# Altium project Ultrasound Smart Probe_Ver2.PrjPcb (part 5 of 9)

## Sheet LVPS RX Supply 3V3 and 1V2_1.SchDoc: LVPS RX Supply 3V3 and 1V2
size 431 x 279 mm; Date: Not shown in title block; ApprovedBy: Not shown in title block; CheckedBy: Not shown in title block; Author: Not shown in title block; CompanyName: Not shown in title block; DrawnBy: Abhishek Vishwa; Engineer: Not shown in title block; Organization: Not shown in title block; Address1: Not shown in title block; Address2: Not shown in title block; Address3: Not shown in title block; Address4: Not shown in title block; DocumentNumber: 1; Revision: Use project parameter SCH_Rev; SheetNumber: 8; SheetTotal: 12; PageSetup: Record=PageOptions|CenterHorizontal=True|CenterVertical=True|PrintScale=1.00|XCorrection=1.00|YCorrection=1.00|PrintKind=0|BorderSize=5000000|LeftOffset=0|BottomOffset=0|Orientation=2|PaperLength=1000|PaperWidth=1000|Scale=100|PaperSource=15|PrintQuality=600|MediaType=1|DitherType=10|PaperKind=Letter|PrintScaleMode=1; CurrentTime: Not shown in title block; CurrentDate: Not shown in title block; Time: Not shown in title block; DocumentFullPathAndName: Not shown in title block; DocumentName: Not shown in title block; ModifiedDate: Not shown in title block; ImagePath: Not shown in title block
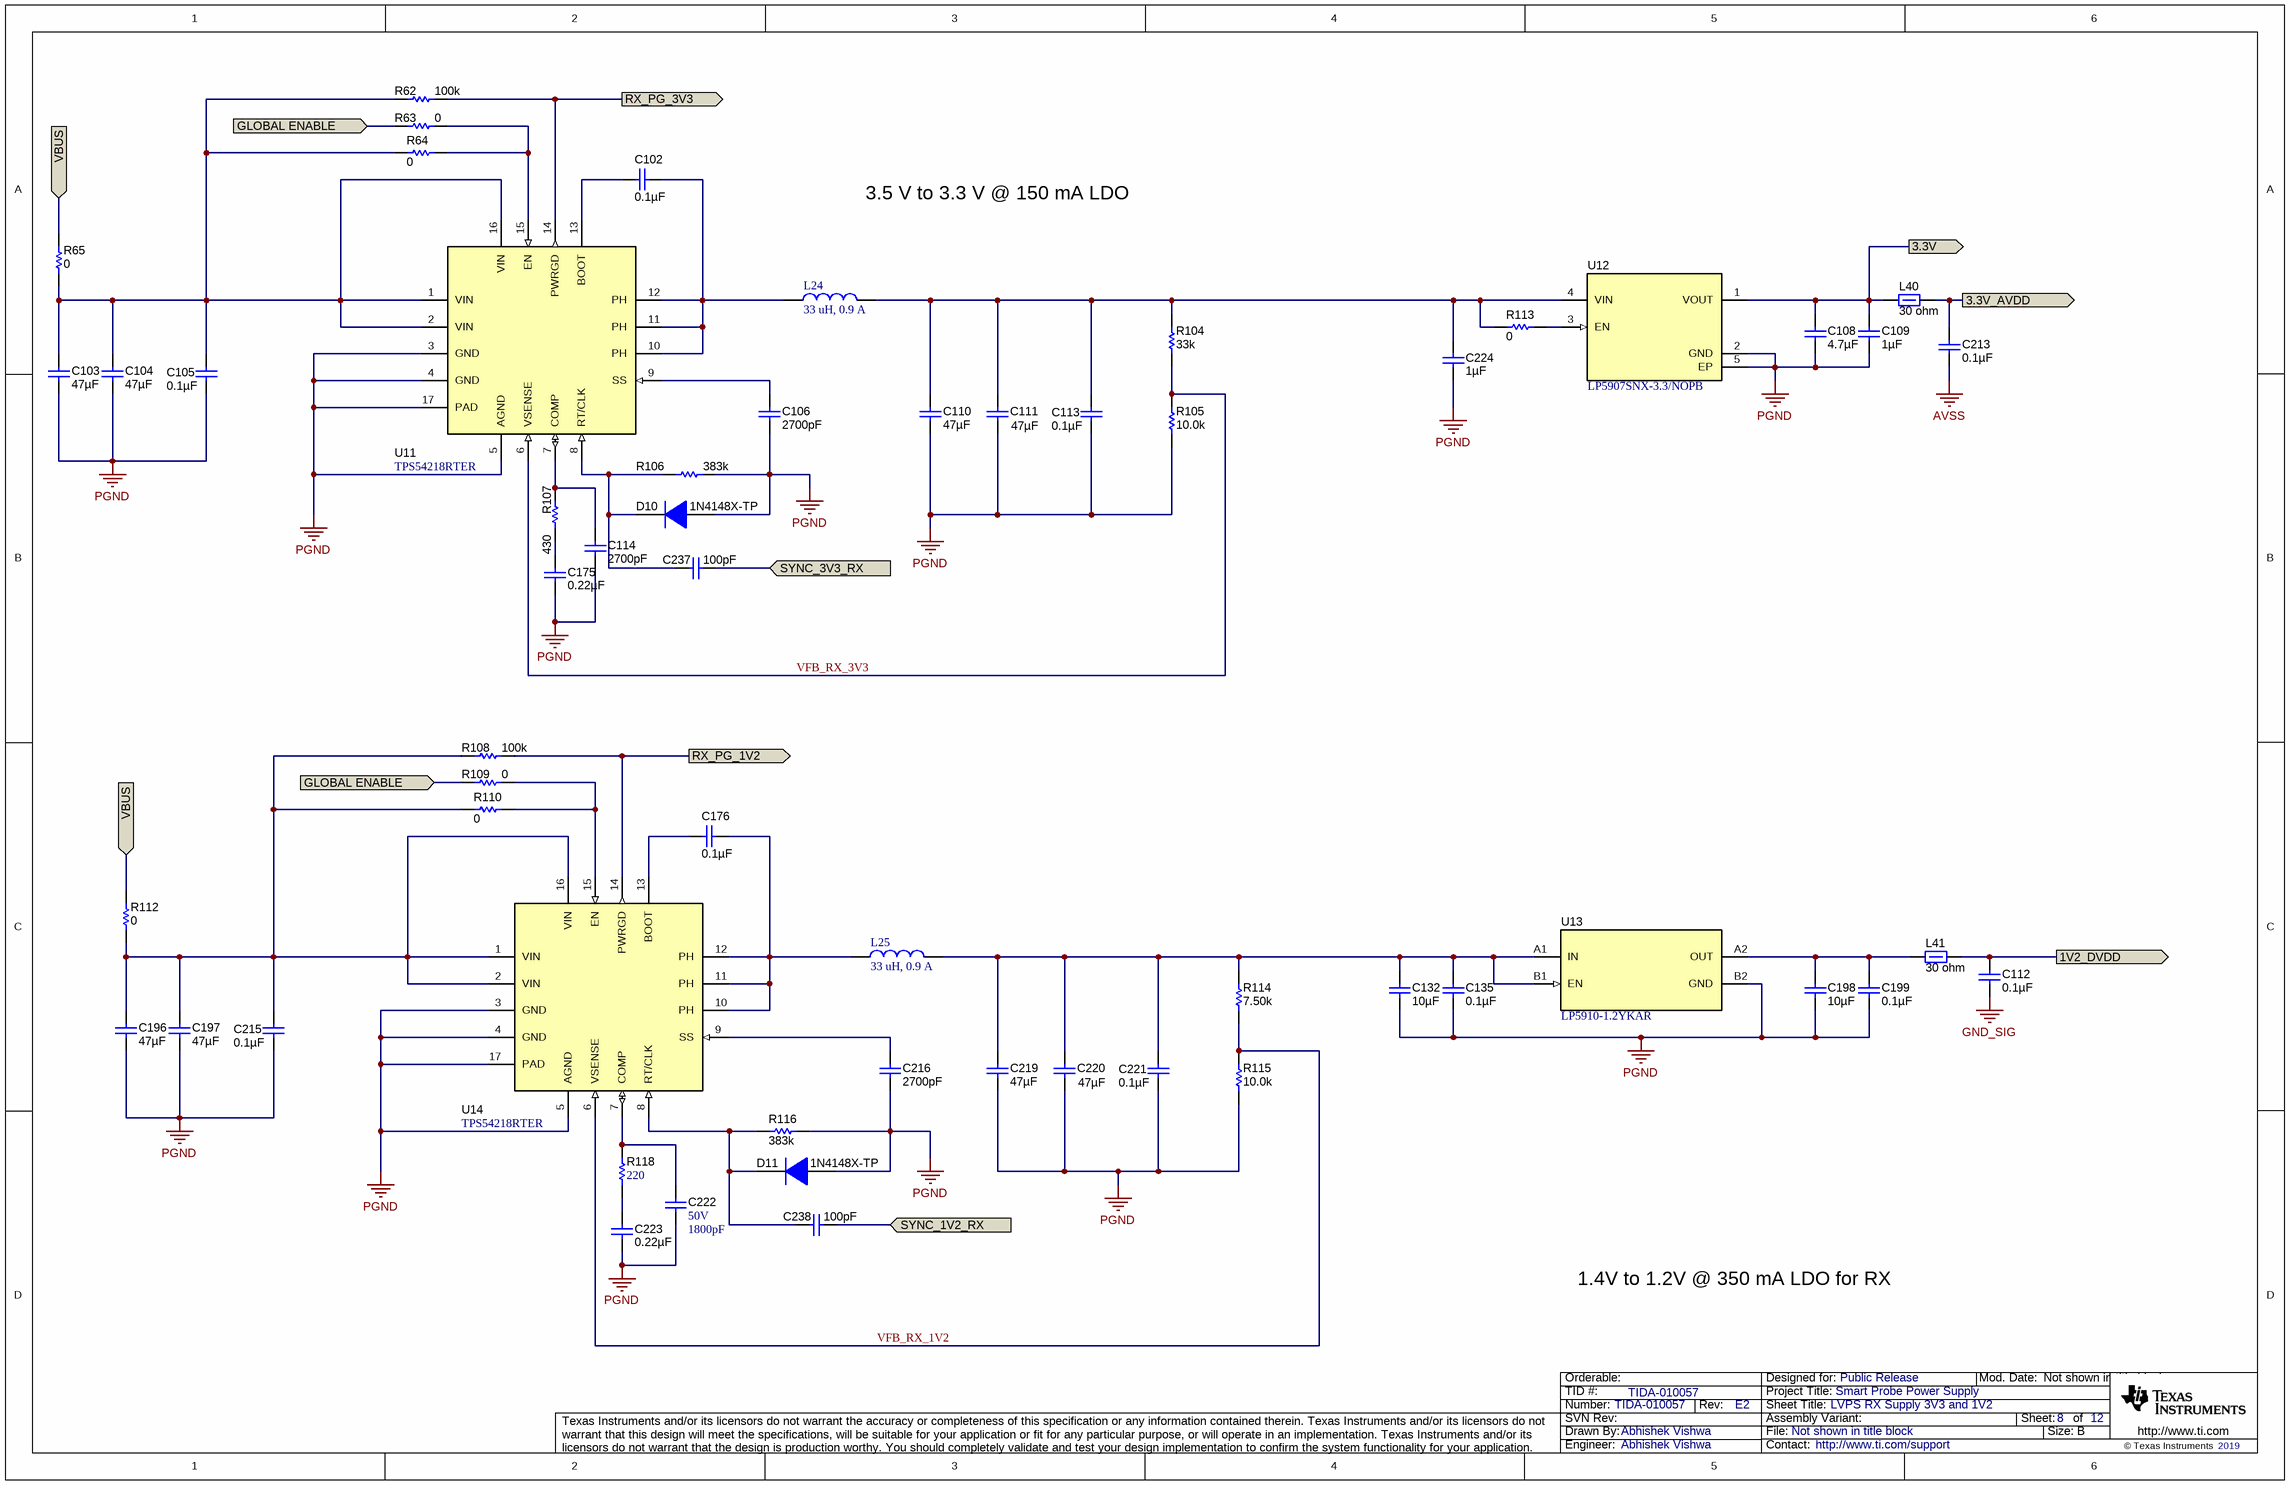
[diagram p5: LVPS RX Supply 3V3 and 1V2_1.SchDoc]

### Parts
C102  ValueDisplayed: 0.1µF  [0603]  (hidden comment: 885012206095)
C103  ValueDisplayed: 47µF  [0805_HV]  (hidden comment: GRM219R60J476ME44D)
C104  ValueDisplayed: 47µF  [0805_HV]  (hidden comment: GRM219R60J476ME44D)
C105  ValueDisplayed: 0.1µF  [0603]  (hidden comment: 885012206095)
C106  ValueDisplayed: 2700pF  [0402]  (hidden comment: CL05B272KB5NNNC)
C108  ValueDisplayed: 4.7µF  [0603]  (hidden comment: GRM188R61A475MAAJ)
C109  ValueDisplayed: 1µF  [0603]  (hidden comment: 885012206052)
C110  ValueDisplayed: 47µF  [0603]  (hidden comment: GRM188R60J476ME15D)
C111  ValueDisplayed: 47µF  [0603]  (hidden comment: GRM188R60J476ME15D)
C112  ValueDisplayed: 0.1µF  [0402]  (hidden comment: GRM155R61E104KA87D)
C113  ValueDisplayed: 0.1µF  [0603]  (hidden comment: 885012206095)
C114  ValueDisplayed: 2700pF  [0402]  (hidden comment: CL05B272KB5NNNC)
C132  ValueDisplayed: 10µF  [0402]  (hidden comment: CL05A106MP5NUNC)
C135  ValueDisplayed: 0.1µF  [0402_065]  (hidden comment: 160R07X104KV4T)
C175  ValueDisplayed: 0.22µF  [0402]  (hidden comment: CL05B224KP5NNNC)
C176  ValueDisplayed: 0.1µF  [0603]  (hidden comment: 885012206095)
C196  ValueDisplayed: 47µF  [0805_HV]  (hidden comment: GRM219R60J476ME44D)
C197  ValueDisplayed: 47µF  [0805_HV]  (hidden comment: GRM219R60J476ME44D)
C198  ValueDisplayed: 10µF  [0402]  (hidden comment: CL05A106MP5NUNC)
C199  ValueDisplayed: 0.1µF  [0402_065]  (hidden comment: 160R07X104KV4T)
C213  ValueDisplayed: 0.1µF  [0402]  (hidden comment: GRM155R61E104KA87D)
C215  ValueDisplayed: 0.1µF  [0603]  (hidden comment: 885012206095)
C216  ValueDisplayed: 2700pF  [0402]  (hidden comment: CL05B272KB5NNNC)
C219  ValueDisplayed: 47µF  [0603]  (hidden comment: GRM188R60J476ME15D)
C220  ValueDisplayed: 47µF  [0603]  (hidden comment: GRM188R60J476ME15D)
C221  ValueDisplayed: 0.1µF  [0603]  (hidden comment: 885012206095)
C222  VDC_V: 50V  ValueDisplayed: 1800pF  [0402]  (hidden comment: GRM155R71H182KA01D)
C223  ValueDisplayed: 0.22µF  [0402]  (hidden comment: CL05B224KP5NNNC)
C224  ValueDisplayed: 1µF  [0603]  (hidden comment: 885012206052)
C237  ValueDisplayed: 100pF  [0402]  (hidden comment: CL05C101JB5NNNC)
C238  ValueDisplayed: 100pF  [0402]  (hidden comment: CL05C101JB5NNNC)
D10  1N4148X-TP  [SOD-523]
D11  1N4148X-TP  [SOD-523]
L24  33 uH, 0.9 A  [WE-TPC_5828]
L25  33 uH, 0.9 A  [WE-TPC_5828]
L40  ValueDisplayed: 30 ohm  [0603]  (hidden comment: 742792609)
L41  ValueDisplayed: 30 ohm  [0603]  (hidden comment: 742792609)
R62  ValueDisplayed: 100k  [0402]  (hidden comment: CRCW0402100KJNED)
R63  ValueDisplayed: 0  [0402]  (hidden comment: ERJ-2GE0R00X)
R64  ValueDisplayed: 0  [0402]  (hidden comment: ERJ-2GE0R00X)
R65  ValueDisplayed: 0  [0603]  (hidden comment: RMCF0603ZT0R00)
R104  ValueDisplayed: 33k  [0402]  (hidden comment: ERJ-2RKF3302X)
R105  ValueDisplayed: 10.0k  [0402]  (hidden comment: ERA-2AEB103X)
R106  ValueDisplayed: 383k  [0402]  (hidden comment: CRCW0402383KFKED)
R107  ValueDisplayed: 430  [0402]  (hidden comment: ERJ-2GEJ431X)
R108  ValueDisplayed: 100k  [0402]  (hidden comment: CRCW0402100KJNED)
R109  ValueDisplayed: 0  [0402]  (hidden comment: ERJ-2GE0R00X)
R110  ValueDisplayed: 0  [0402]  (hidden comment: ERJ-2GE0R00X)
R112  ValueDisplayed: 0  [0603]  (hidden comment: RMCF0603ZT0R00)
R113  ValueDisplayed: 0  [0402]  (hidden comment: ERJ-2GE0R00X)
R114  ValueDisplayed: 7.50k  [0402]  (hidden comment: ERA-2AEB752X)
R115  ValueDisplayed: 10.0k  [0402]  (hidden comment: ERA-2AEB103X)
R116  ValueDisplayed: 383k  [0402]  (hidden comment: CRCW0402383KFKED)
R118  ValueDisplayed: 220  [0402]  (hidden comment: CRCW0402150RJNED)
U11  TPS54218RTER  [RTE0016F]
U12  LP5907SNX-3.3/NOPB  [DQN0004A]
U13  LP5910-1.2YKAR  [YKA0004ACAC]
U14  TPS54218RTER  [RTE0016F]

### Ports
1V2_DVDD (out), 3.3V (out), 3.3V_AVDD (out), GLOBAL ENABLE (in), RX_PG_1V2 (out), RX_PG_3V3 (out), SYNC_1V2_RX (in), SYNC_3V3_RX (in), VBUS (in)

### Nets
AVSS: C213.1
GND_SIG: C112.1
PGND: C103.2 C104.2 C105.2 C106.2 C108.2 C109.2 C110.2 C111.2 C113.2 C114.2 C132.2 C135.2 C175.1 C196.2 C197.2 C198.2 C199.2 C215.2 C216.2 C219.2 C220.2 C221.2 C222.2 C223.1 C224.2 D10.2(A) D11.2(A) R105.1 R106.2 R115.1 R116.2 U11.3(GND) U11.4(GND) U11.5(AGND) U11.17(PAD) U12.2(GND) U12.5(EP) U13.B2(GND) U14.3(GND) U14.4(GND) U14.5(AGND) U14.17(PAD)
1V2_DVDD: C112.2 L41.1 ; port 1V2_DVDD
3.3V: C108.1 C109.1 L40.1 U12.1(VOUT) ; port 3.3V
3.3V_AVDD: C213.2 L40.2 ; port 3.3V_AVDD
GLOBAL ENABLE: R63.1 R109.1 ; port GLOBAL ENABLE
RX_PG_1V2: R108.2 U14.14(PWRGD) ; port RX_PG_1V2
RX_PG_3V3: R62.2 U11.14(PWRGD) ; port RX_PG_3V3
SYNC_1V2_RX: C238.1 ; port SYNC_1V2_RX
SYNC_3V3_RX: C237.1 ; port SYNC_3V3_RX
VBUS: R65.2 R112.2 ; port VBUS
VFB_RX_1V2: R114.1 R115.2 U14.6(VSENSE)
VFB_RX_3V3: R104.1 R105.2 U11.6(VSENSE)
NetC102_1: C102.1 U11.13(BOOT)
NetC102_2: C102.2 L24.1 U11.10(PH) U11.11(PH) U11.12(PH)
NetC103_1: C103.1 C104.1 C105.1 R62.1 R64.1 R65.1 U11.1(VIN) U11.2(VIN) U11.16(VIN)
NetC106_1: C106.1 U11.9(SS)
NetC110_1: C110.1 C111.1 C113.1 C224.1 L24.2 R104.2 R113.2 U12.4(VIN)
NetC114_1: C114.1 R107.2 U11.7(COMP)
NetC132_1: C132.1 C135.1 C219.1 C220.1 C221.1 L25.2 R114.2 U13.A1(IN) U13.B1(EN)
NetC175_2: C175.2 R107.1
NetC176_1: C176.1 U14.13(BOOT)
NetC176_2: C176.2 L25.1 U14.10(PH) U14.11(PH) U14.12(PH)
NetC196_1: C196.1 C197.1 C215.1 R108.1 R110.1 R112.1 U14.1(VIN) U14.2(VIN) U14.16(VIN)
NetC198_1: C198.1 C199.1 L41.2 U13.A2(OUT)
NetC216_1: C216.1 U14.9(SS)
NetC222_1: C222.1 R118.2 U14.7(COMP)
NetC223_2: C223.2 R118.1
NetC237_2: C237.2 D10.1(K) R106.1 U11.8(RT/CLK)
NetC238_2: C238.2 D11.1(K) R116.1 U14.8(RT/CLK)
NetR63_2: R63.2 R64.2 U11.15(EN)
NetR109_2: R109.2 R110.2 U14.15(EN)
NetR113_1: R113.1 U12.3(EN)

### Notes on the sheet
- 3.5 V to 3.3 V @ 150 mA LDO
- 1.4V to 1.2V @ 350 mA LDO for RX
- Drawn By:
- SVN Rev:
- Number:
- TID #:
- Orderable:
- Rev:
- Sheet Title:
- File:
- Project Title:
- Designed for:
- Assembly Variant:
- Mod. Date:
- Sheet:
- Size:
- of
- B
- http://www.ti.com
- Texas Instruments and/or its licensors do not warrant the accuracy or completeness of this specification or any information contained therein. Texas Instruments and/or its licensors do not warrant that this design will meet the specifications, will be suitable for your application or fit for any particular purpose, or will operate in an implementation. Texas Instruments and/or its licensors do not warrant that the design is production worthy. You should completely validate and test your design implementation to confirm the system functionality for your application.
- Engineer:
- Contact:
- © Texas Instruments

### Library data of the parts
C102 C105 C113 C176 C215 C221 = 885012206095: as C39 on sheet LVPS_FX3_Supply; SymbolVersion: 2008-07-09; PartNumber: 885012206095; PackageReference: 0603; RoHS: Y; MountType: SMT; Technology: Ceramic; TempCo: X7R; Cap_Case: 0603; Published: 2008-06-19; Publisher: Texas Instruments; LatestRevisionDate: 2017-06-22; ComponentLink1Description: Datasheet link; ComponentLink1URL: http://katalog.we-online.de/pbs/datasheet/885012206095.pdf; AEC Qualified: N; AEC Grade: N/A; Green_EU RoHS: Passed; Green_EU RoHS-2: Incomplete
C103 C104 C196 C197 = GRM219R60J476ME44D: as C41 on sheet LVPS_FX3_Supply; SymbolVersion: 2008-07-09; PartNumber: GRM219R60J476ME44D; PackageReference: 0805; RoHS: Y; MountType: SMT; Technology: Ceramic; TempCo: X5R; Published: 2008-06-19; Publisher: Texas Instruments; LatestRevisionDate: 2017-06-22; ComponentLink1Description: Datasheet link; ComponentLink1URL: http://psearch.en.murata.com/capacitor/product/GRM219R60J476ME44%23.pdf; Supplier 1: Digi-Key; Supplier Part Number 1: 490-13249-1-ND; Supplier 2: Mouser; Supplier Part Number 2: 81-GRM219R60J476ME4D; AEC Qualified: N; AEC Grade: N/A; Green_EU RoHS: Passed; Green_EU RoHS-2: Incomplete
C106 C114 C216 = GRM155R71H272KA01D: as C45 on sheet LVPS_FX3_Supply; SymbolVersion: 2008-07-09; PartNumber: CL05B272KB5NNNC; PackageReference: 0402; RoHS: Y; MountType: SMT; Technology: Ceramic; TempCo: X7R; Cap_Case: 0402; SizeY_mm: 0.5; Published: 2008-06-19; Publisher: Texas Instruments; LatestRevisionDate: 2017-06-22; ComponentLink1Description: Datasheet link; ComponentLink1URL: http://search.murata.co.jp/Ceramy/PnsearchViewAction.do?HnOFG=ON&HnNFG=ON&SEL_CNT=50&sLang=en&sKey=GRM155R71H272KA01D&x=9&y=9&search=startwith; Supplier 1: Digi-Key; Supplier Part Number 1: 1276-1268-1-ND; Supplier 2: Mouser; AEC Qualified: ?
C108 = GRM188R61A475MAAJ: as C234 on sheet Input Output Connector; SymbolVersion: 2008-07-09; PartNumber: GRM188R61A475MAAJ; PackageReference: 0603; RoHS: Y; MountType: SMT; Technology: Ceramic; TempCo: X5R; Cap_Case: 0603; Published: 2008-06-19; Publisher: Texas Instruments; LatestRevisionDate: 2017-06-22; ComponentLink1Description: Datasheet link; ComponentLink1URL: http://psearch.en.murata.com/capacitor/product/GRM188R61A475MAAJ%23.pdf; AEC Qualified: N; AEC Grade: N/A
C109 C224 = 885012206052: as C235 on sheet Input Output Connector; SymbolVersion: 2008-07-09; PartNumber: 885012206052; PackageReference: 0603; RoHS: Y; MountType: SMT; Technology: Ceramic; TempCo: X7R; Cap_Case: 0603; Published: 2008-06-19; Publisher: Texas Instruments; LatestRevisionDate: 2017-06-22; ComponentLink1Description: Datasheet link; ComponentLink1URL: http://katalog.we-online.de/pbs/datasheet/885012206052.pdf; Supplier 1: Mouser; Supplier Part Number 1: 710-885012206052; AEC Qualified: N; AEC Grade: N/A; Green_EU RoHS: Passed; Green_EU RoHS-2: Incomplete
C110 C111 C219 C220 = GRM188R60J476ME15D: as C46 on sheet LVPS_FX3_Supply; SymbolVersion: 2008-07-09; PartNumber: GRM188R60J476ME15D; PackageReference: 0603; RoHS: Y; MountType: SMT; Technology: Ceramic; TempCo: X5R; Cap_Case: 0603; Published: 2008-06-19; Publisher: Texas Instruments; LatestRevisionDate: 2017-06-22; ComponentLink1Description: Datasheet link; ComponentLink1URL: http://psearch.en.murata.com/capacitor/product/GRM188R60J476ME15%23.pdf; AEC Qualified: ?; Green_EU RoHS: Passed; Green_EU RoHS-2: Incomplete
C112 C213 = GRM155R61E104KA87D: as C165-C170 on sheet Input Output Connector; SymbolVersion: 2008-07-09; PartNumber: GRM155R61E104KA87D; PackageReference: 0402; RoHS: Y; MountType: SMT; Technology: Ceramic; TempCo: X5R; Cap_Case: 0402; SizeY_mm: 0.5; Published: 2008-06-19; Publisher: Texas Instruments; LatestRevisionDate: 2017-06-22; ComponentLink1Description: Datasheet link; ComponentLink1URL: http://psearch.murata.com/capacitor/product/GRM155R61E104KA87%23.pdf; Supplier 1: Digi-Key; Supplier Part Number 1: 490-5920-1-ND; Supplier 2: Mouser; Supplier Part Number 2: 81-GRM155R61E104KA7D; AEC Qualified: N; AEC Grade: N/A; Green_EU RoHS: Passed; Green_EU RoHS-2: Passed
C132 C198 = GRM155R61A106ME11: CAP, CERM, 10 µF, 10 V,+/- 20%, X5R, 0402; Manufacturer: Samsung Electro-Mechanics; Polarized: N; CompType: Capacitor; Value: 10uF; U/M: EA; Cap_F: 0.00001; Tolerance_%: 20; VDC_V: 10; Value2: 10V; TaMin_C: -55; TaMax_C: 85; SizeArea_mm2: 0.5; SizeAreaWB_mm2: 3; SizeX_mm: 1; SizeZ_mm: 0.6; AEC Category: Q200; SymbolVersion: 2008-07-09; PartNumber: CL05A106MP5NUNC; PackageReference: 0402; RoHS: Y; MountType: SMT; Technology: Ceramic; TempCo: X5R; Cap_Case: 0402; SizeY_mm: 0.5; Published: 2008-06-19; Publisher: Texas Instruments; LatestRevisionDate: 2017-06-22; ComponentLink1Description: Datasheet link; ComponentLink1URL: https://sps06.itg.ti.com/sites/KMS/crossdivteams/altium/docs/ComponentDatasheets/GRM155R61A106ME11 Electrical Characteristics Data.pdf; AEC Qualified: ?
C135 C199 = 160R07X104KV4T: CAP, CERM, 0.1 µF, 16 V,+/- 10%, X5R, 0402; Manufacturer: Johanson Technology; Polarized: N; CompType: Capacitor; Value: 0.1uF; U/M: EA; Cap_F: 0.0000001; Tolerance_%: 10; VDC_V: 16; Value2: 16V; TaMin_C: -55; TaMax_C: 85; Cap_Case: 0402; SizeArea_mm2: 0.5; SizeAreaWB_mm2: 3; SizeX_mm: 1; SizeZ_mm: 0.65; AEC Category: Q200; Green_Lifecycle: Not Set; Green_REACh: Incomplete; SymbolVersion: 2008-07-09; PartNumber: 160R07X104KV4T; PackageReference: 0402; RoHS: Y; MountType: SMT; Technology: Ceramic; TempCo: X5R; SizeY_mm: 0.5; Published: 2008-06-19; Publisher: Texas Instruments; LatestRevisionDate: 2017-06-22; ComponentLink1Description: Datasheet link; ComponentLink1URL: http://www.johansondielectrics.com/downloads/jdi-product-catalog.pdf; Supplier 1: Digi-Key; Supplier Part Number 1: 709-1129-1-ND; Supplier 2: Newark; Supplier Part Number 2: 45W5808; Supplier 3: Mouser; Supplier Part Number 3: 605-160R07X104KV4T; AEC Qualified: N; AEC Grade: N/A; Green_EU RoHS: Incomplete; Green_EU RoHS-2: Incomplete
C175 C223 = GRM155R61E104KA87D: CAP CER 0.22UF 10V X7R 0402; Manufacturer: Samsung Electro-Mechanics; Polarized: N; CompType: Capacitor; U/M: EA; Cap_F: 0.0000001; Tolerance_%: 1%; VDC_V: 25; TempCo: X5R; TaMin_C: -55; TaMax_C: 85; SizeArea_mm2: 0.5; SizeAreaWB_mm2: 3; SizeX_mm: 1; SizeZ_mm: 0.6; AEC Category: Q200; Green_Lifecycle: Active; Green_REACh: Passed; SymbolVersion: 2008-07-09; Value: 0.22uF; PartNumber: CL05B224KP5NNNC; PackageReference: 0402; RoHS: Y; Value2: 10V; MountType: SMT; Technology: Ceramic; Cap_Case: 0402; SizeY_mm: 0.5; Published: 2008-06-19; Publisher: Texas Instruments; LatestRevisionDate: 2017-06-22; ComponentLink1Description: Datasheet link; ComponentLink1URL: http://psearch.murata.com/capacitor/product/GRM155R61E104KA87%23.pdf; AEC Qualified: N; AEC Grade: N/A; Green_EU RoHS: Passed; Green_EU RoHS-2: Passed
C222 = CMP-0006680-2: CAP, CERM, 1800 pF, 50 V, +/- 10%, X7R, 0402; Manufacturer: MuRata; TaMin_C: -55°C; Polarized: N; SizeAreaWB_mm2: 3; Value1: Unknown; U/M: EA; Value: 1800pF; TaMax_C: 125°C; SizeZ_mm: 0.6; SizeX_mm: 1; SizeY_mm: 0.5; Cap_F: 1.8nF; AEC Category: Q200; Supplier Part Number 2: 81-GRM155R71H182KA1D; Publisher: Texas Instruments; Supplier 2: Mouser; TempCo: X7R; Published: 2008-06-19; RoHS: Y; MountType: SMT; Supplier 1: Digi-Key; PackageReference: 0402; Tolerance_%: 10%; Cap_Case: 0402; Value2: 50V; SizeArea_mm2: 0.5; CompType: Capacitor; LatestRevisionDate: 2017-03-09; PartNumber: GRM155R71H182KA01D; AEC Qualified: ?; ComponentLink1Description: Datasheet link; Supplier Part Number 1: 490-3246-1-ND; Technology: Ceramic; ComponentLink1URL: http://search.murata.co.jp/Ceramy/PnsearchViewAction.do?HnOFG=ON&HnNFG=ON&SEL_CNT=50&sLang=en&sKey=GRM155R71H182KA01D&x=9&y=9&search=startwith
C237 C238 = 0402YC101KAT2A: as C239 on sheet LVPS_FX3_Supply; SymbolVersion: 2008-07-09; Value: 100pF; PartNumber: CL05C101JB5NNNC; PackageReference: 0402; RoHS: Y; MountType: SMT; Technology: Ceramic; Cap_Case: 0402; SizeY_mm: 0.5; Published: 2008-06-19; Publisher: Texas Instruments; LatestRevisionDate: 2017-06-22; ComponentLink1Description: Datasheet link; ComponentLink1URL: http://datasheets.avx.com/X7RDielectric.pdf; Supplier 1: Digi-Key; Supplier Part Number 1: 1276-1025-1-ND; Supplier 2: Newark; Supplier 3: Mouser; AEC Qualified: N; AEC Grade: N/A
D10 D11 = 1N4148X-TP: as D12 on sheet LVPS_FX3_Supply; SymbolVersion: 2008-12-08; PartNumber: 1N4148X-TP; PackageReference: SOD-523; CompType: Diode; MountType: SMT; Type: Switching; RoHS: Y; Published: 2008-06-26; Publisher: Texas Instruments; LatestRevisionDate: 2017-06-26; ComponentLink1Description: Datasheet link; ComponentLink1URL: http://www.mccsemi.com/up_pdf/1N4148X(SOD-523).PDF; Supplier 1: Digi-Key; Supplier Part Number 1: 1N4148XTPMSCT-ND; Supplier 2: Newark; Supplier Part Number 2: 69R6666; Supplier 3: Mouser; Supplier Part Number 3: 833-1N4148X-TP; AEC Qualified: ?; Green_EU RoHS: Incomplete; Green_EU RoHS-2: Incomplete
L24 L25 = 744053330: as L6 on sheet LVPS_FX3_Supply; ComponentLink1Description: Manufacturer; ComponentLink1URL: http://www.we-online.de; ComponentLink2Description: Datasheet; ComponentLink2URL: https://katalog.we-online.com/pbs/datasheet/744053330.pdf; Part Number: 744053330; Published Date: December 2018; Publisher: Wurth Elektronik; Size: 5828; Operating Temperature: -40 to +125 degC; Mounting Technology: SMT; Packaging: Tape and Reel
L40 L41 = 742792609: as L32 on sheet Input Output Connector; SymbolVersion: 2017-01-06; PartNumber: 742792609; CompType: Ferrite Bead; MountType: SMT; PackageReference: 0603; Published: 2014-04-30; Publisher: Texas Instruments; LatestRevisionDate: 2017-06-22; ComponentLink1Description: Datasheet link; ComponentLink1URL: http://katalog.we-online.de/pbs/datasheet/742792609.pdf; RoHS: Y; Supplier 1: Digi-Key; Supplier Part Number 1: 732-1591-1-ND; Supplier 2: Mouser; Supplier Part Number 2: 710-742792609; Green_EU RoHS: Passed; Green_EU RoHS-2: Incomplete
R62 R108 = CRCW0402100KJNED: as R46 on sheet LVPS_FX3_Supply; SymbolVersion: 2009-05-29; PartNumber: CRCW0402100KJNED; PackageReference: 0402; RoHS: Y; Value_Code: 100k; Value1: 5%; MountType: SMT; Technology: Thick Film; SizeY_mm: 0.5; Published: 2008-06-26; Publisher: Texas Instruments; LatestRevisionDate: 2017-06-12; ComponentLink1Description: Datasheet link; ComponentLink1URL: http://www.vishay.com/docs/20035/dcrcwe3.pdf; Supplier 1: Digi-Key; Supplier Part Number 1: 541-100KJCT-ND; Supplier 2: Newark; Supplier Part Number 2: 59M6699; Supplier 3: Mouser; Supplier Part Number 3: 71-CRCW0402J-100K-E3; AEC Qualified: ?; Green_EU RoHS: Passed with Exemption; Green_EU RoHS-2: Passed
R63 R64 R109 R110 R113 = ERJ-2GE0R00X: as R25 on sheet Input Output Connector; SymbolVersion: 2009-05-29; PartNumber: ERJ-2GE0R00X; PackageReference: 0402; RoHS: Y; Res_ohm: 0; Value1: 5%; MountType: SMT; Technology: Thick Film; SizeY_mm: 0.5; Published: 2008-06-26; Publisher: Texas Instruments; LatestRevisionDate: 2017-06-12; ComponentLink1Description: Datasheet link; ComponentLink1URL: http://www.panasonic.com/industrial/components/pdf/AOA0000CE1.pdf; Supplier 1: Digi-Key; Supplier Part Number 1: P0.0JCT-ND; Supplier 2: Newark; Supplier Part Number 2: 65T8307; Supplier 3: Mouser; Supplier Part Number 3: 667-ERJ-2GE0R00X; AEC Qualified: ?; Green_EU RoHS: Passed with Exemption; Green_EU RoHS-2: Passed
R65 R112 = RMCF0603ZT0R00: as R49 on sheet LVPS_FX3_Supply; SymbolVersion: 2009-05-29; PartNumber: RMCF0603ZT0R00; PackageReference: 0603; RoHS: Y; Res_ohm: 0; Value_Code: 0; Value1: 1%; MountType: SMT; Technology: Thick Film; SizeZ_mm: 1; Published: 2008-06-26; Publisher: Texas Instruments; LatestRevisionDate: 2017-06-13; ComponentLink1Description: Datasheet link; ComponentLink1URL: https://www.seielect.com/Catalog/SEI-RMCF_RMCP.pdf; Supplier 1: Digi-Key; Supplier Part Number 1: RMCF0603ZT0R00CT-ND; AEC Grade: 0; Green_EU RoHS: Passed with Exemption; Green_EU RoHS-2: Incomplete
R104 = ERJ-2RKF4991X: RES SMD 33K OHM 1% 1/10W 0402; Manufacturer: Panasonic Electronic Components; CompType: Resistor; Res_ohm: 4990; Tolerance_%: 1; Power_W: 0.1; Value2: 0.1W; VDC_V: 50; TempCo: 100 ppm/C; SizeArea_mm2: 0.5; SizeZ_mm: 0.6; EIA_Code: E96; U/M: EA; AEC Qualified: Y; AEC Grade: 0; Green_Lifecycle: Active; Green_REACh: Passed; SymbolVersion: 2009-05-29; Value: 33k; PartNumber: ERJ-2RKF3302X; PackageReference: 0402; RoHS: Y; Value1: 1%; MountType: SMT; Technology: Thick Film; SizeX_mm: 1; SizeY_mm: 0.5; Published: 2008-06-26; Publisher: Texas Instruments; ComponentLink1Description: Datasheet link; ComponentLink1URL: http://industrial.panasonic.com/cdbs/www-data/pdf/RDA0000/AOA0000C86.pdf; Green_EU RoHS-2: Passed
R105 R115 = RK73H1ETTP1002F: as R51 on sheet LVPS_FX3_Supply; SymbolVersion: 2009-05-29; PartNumber: ERA-2AEB103X; PackageReference: 0402; RoHS: Y; Value1: 0.1%; MountType: SMT; Technology: Thick Film; SizeX_mm: 1; SizeY_mm: 0.5; Published: 2008-06-26; Publisher: Texas Instruments; LatestRevisionDate: 2017-06-12; ComponentLink1Description: Datasheet link; ComponentLink1URL: http://www.koaspeer.com/catimages/Products/RK73H/RK73H.pdf; Supplier 1: Mouser; Supplier Part Number 1: P10KDCCT-ND
R106 R116 = CRCW0402383KFKED: as R60 on sheet LVPS_FX3_Supply; SymbolVersion: 2009-05-29; PartNumber: CRCW0402383KFKED; PackageReference: 0402; RoHS: Y; Value_Code: 383k; Value1: 1%; MountType: SMT; Technology: Thick Film; SizeX_mm: 1; SizeY_mm: 0.5; Published: 2008-06-26; Publisher: Texas Instruments; LatestRevisionDate: 2017-06-12; ComponentLink1Description: Datasheet link; ComponentLink1URL: http://www.vishay.com/docs/20035/dcrcwe3.pdf; Supplier 1: Digi-Key; Supplier Part Number 1: 541-383KLCT-ND; Supplier 2: Newark; Supplier Part Number 2: 52K7024; Supplier 3: Mouser; Supplier Part Number 3: 71-CRCW0402-383K-E3; AEC Qualified: ?; Green_EU RoHS: Passed with Exemption; Green_EU RoHS-2: Passed
R107 = CRCW0402130RJNED: RES SMD 430 OHM 5% 1/10W 0402; Manufacturer: Panasonic Electronic Components; CompType: Resistor; Value: 130; Value_Code: 130R; Tolerance_%: 5; Value1: 1%; Power_W: 0.063; Value2: 0.063W; VDC_V: 50; TempCo: 200 ppm/C; SizeArea_mm2: 0.5; SizeX_mm: 1; SizeZ_mm: 0.6; EIA_Code: E24; U/M: EA; AEC Category: Q200; Green_Lifecycle: Active; Green_REACh: Passed; SymbolVersion: 2009-05-29; PartNumber: ERJ-2GEJ431X; PackageReference: 0402; RoHS: Y; Res_ohm: 130; MountType: SMT; Technology: Thick Film; SizeY_mm: 0.5; Published: 2008-06-26; Publisher: Texas Instruments; LatestRevisionDate: 2017-06-12; ComponentLink1Description: Datasheet link; ComponentLink1URL: http://www.vishay.com/docs/20035/dcrcwe3.pdf; AEC Qualified: ?; Green_EU RoHS-2: Passed
R114 = ERA-2AEB752X: RES, 7.50 k, 0.1%, 0.063 W, AEC-Q200 Grade 0, 0402; Manufacturer: Panasonic; CompType: Resistor; Value: 7.50k; Res_ohm: 7500; Value_Code: 7k50; Tolerance_%: 0.1; Power_W: 0.063; Value2: 0.063W; VDC_V: 50; TempCo: 25 ppm/C; SizeArea_mm2: 0.5; SizeX_mm: 1; SizeZ_mm: 0.6; EIA_Code: E192; U/M: EA; AEC Category: Q200; AEC Qualified: Y; AEC Grade: 0; SymbolVersion: 2009-05-29; PartNumber: ERA-2AEB752X; PackageReference: 0402; RoHS: Y; Value1: 0.1%; MountType: SMT; Technology: Thin Film; SizeY_mm: 0.5; Published: 2008-06-26; Publisher: Texas Instruments; LatestRevisionDate: 2017-06-12; ComponentLink1Description: Datasheet link; ComponentLink1URL: http://industrial.panasonic.com/lecs/www-data/pdf/AOA0000/AOA0000CE26.pdf; Supplier 1: Digi-Key; Supplier Part Number 1: P7.5KDCCT-ND; Supplier 2: Newark; Supplier Part Number 2: 49W8962; Supplier 3: Mouser; Supplier Part Number 3: 667-ERA-2AEB752X
R118 = CMP-0026841-3: RES, 150, 5%, 0.063 W, AEC-Q200 Grade 0, 0402; Manufacturer: Panasonic Electronic Components; PartNumber: ERJ-2RKF2200X; Power_W: 63mW; TempCo: 200 ppm/C; Value_Code: 220R; Value1: 1%; Value: 220; EIA_Code: E24; SizeX_mm: 1; SizeY_mm: 0.5; SizeZ_mm: 0.6; Value2: 0.063W; AEC Qualified: Y; VDC_V: 50V; AEC Category: Q200; AEC Grade: 0; RoHS: E; MountType: SMT; PackageReference: 0402; Tolerance_%: 1%; Res_ohm: 220; SizeArea_mm2: 0.5; CompType: Resistor; ComponentLink1Description: Datasheet link; Technology: Thick Film; ComponentLink1URL: http://www.vishay.com/docs/20035/dcrcwe3.pdf
U11 U14 = CMP-0073970-1: as U4 on sheet LVPS_FX3_Supply; ComponentLink1URL: http://www.ti.com/lit/ds/symlink/tps54218.pdf; Publisher: Texas Instruments; PackageDescription: WQFN-16; RoHS: Y; Footprint Path 6: C:\AltiumLibraries\Footprints\TI\.PcbLib; MountType: SMT; Green_EU RoHS-2: Passed; Manufacturer: Texas Instruments; Green_EU RoHS: Passed; PackageReference: RTE0016F; SizeY_mm: 3.0; LatestRevisionDate: 2017-06-09; PartNumber: TPS54218RTER; ComponentLink1Description: Datasheet Link
U12 = CMP-0076246-1: 250-mA Ultra-Low-Noise, Low-IQ LDO, DQN0004A (X2SON-4); Manufacturer: Texas Instruments; SizeAreaWB_mm2: 4.0; SizeArea_mm2: 1.0; SizeZ_mm: 0.4; Green_REACh: Passed; Green_Lifecycle: Active; U/M: EA; CompType: IC; ComponentLink1Description: Datasheet Link; RoHS: Y; Green_EU RoHS: Passed; PackageReference: DQN0004A; PartNumber: LP5907SNX-3.3/NOPB; Publisher: Texas Instruments; PackageDescription: X2SON-4; SizeY_mm: 1.0; Alternate Manufacturer: Texas Instruments; LatestRevisionDate: 2017-06-09; ComponentLink1URL: http://www.ti.com/lit/ds/symlink/lp5907.pdf; MountType: SMT; SizeX_mm: 1.0; Green_EU RoHS-2: Passed
U13 = CMP-0076252-2: 300-mA Low-Noise, Low-IQ LDO, YKA0004ACAC (DSBGA-4); Manufacturer: Texas Instruments; SizeZ_mm: 0.4; SizeX_mm: 0.712; SizeArea_mm2: 0.506944; CompType: IC; U/M: EA; SizeAreaWB_mm2: 2.930944; ComponentLink1URL: http://www.ti.com/lit/ds/symlink/lp5910.pdf; Publisher: Texas Instruments; PackageDescription: DSBGA-4; SizeY_mm: 0.712; PackageReference: YKA0004ACAC; LatestRevisionDate: 2017-06-09; PartNumber: LP5910-1.2YKAR; ComponentLink1Description: Datasheet Link; MountType: SMT; Alternate Manufacturer: Texas Instruments